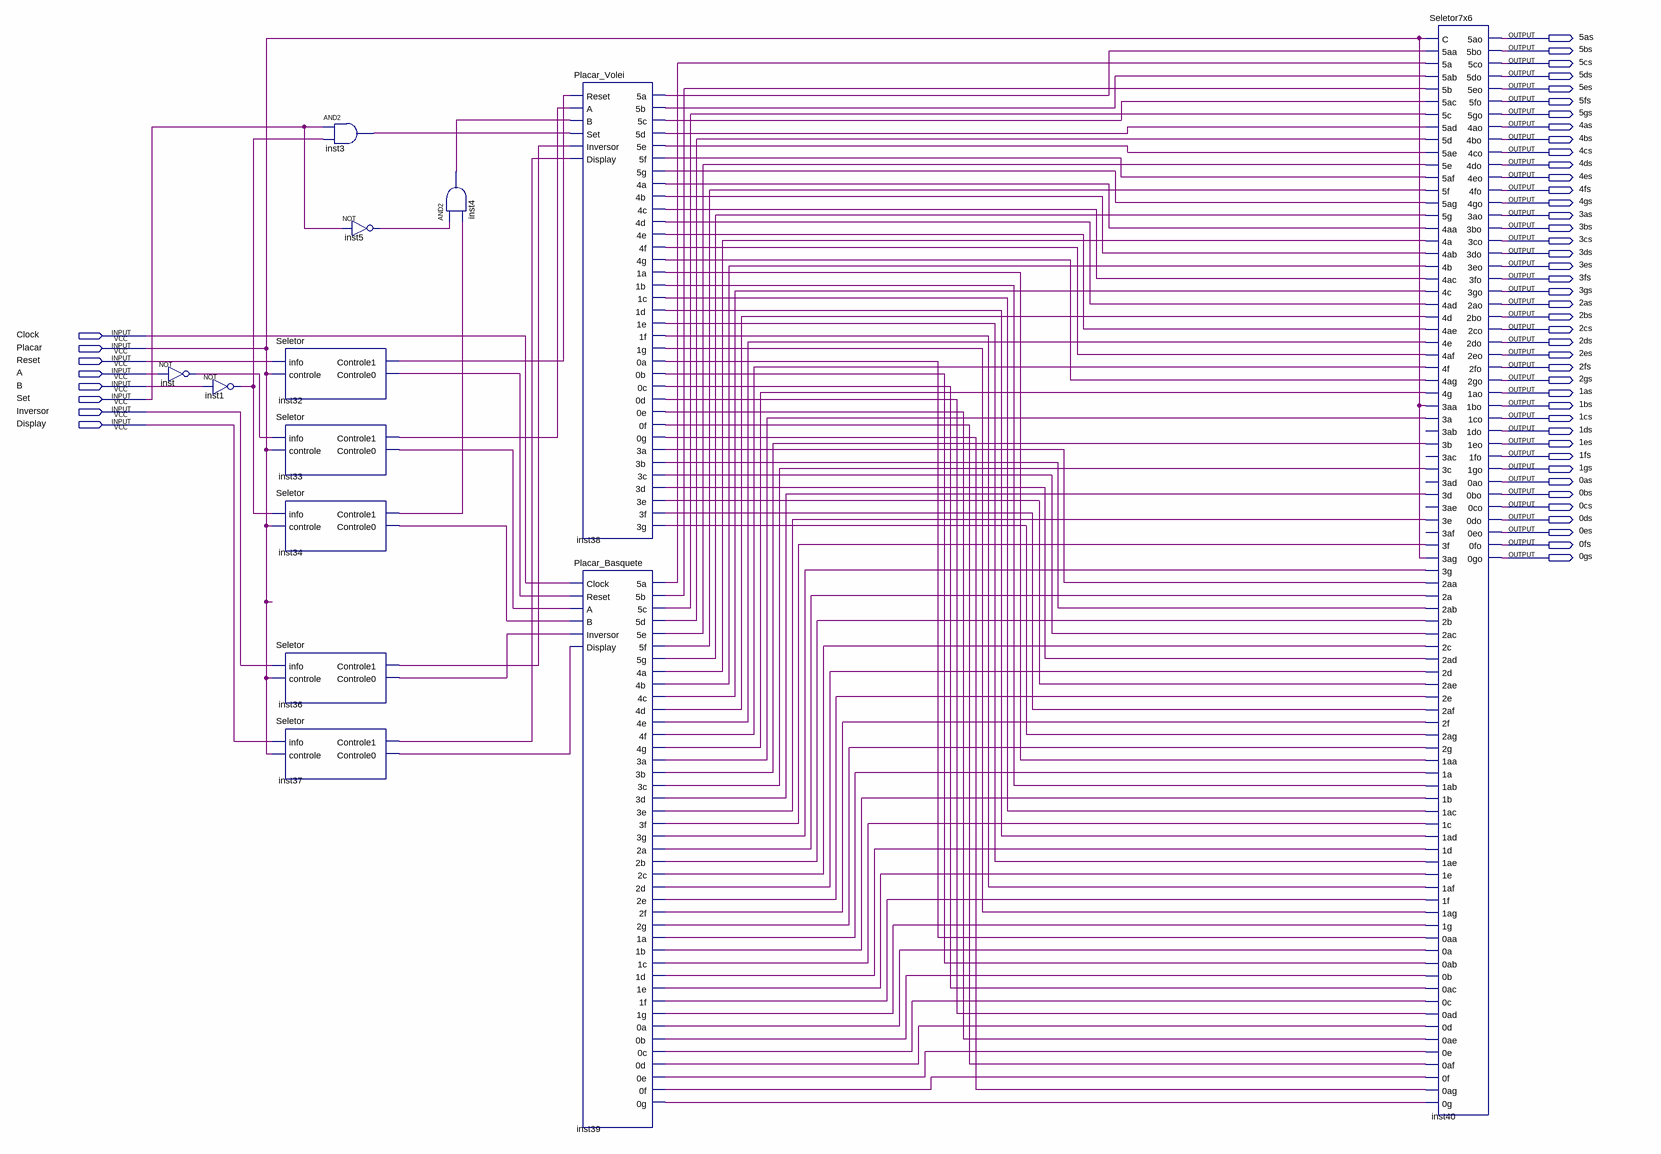
[diagram p0: schematic sheet]
// Quartus schematic Placar.bdf as structural Verilog: 13 symbols, 50 pins
module Placar (
  input  Clock,
  input  Placar,
  input  Reset,
  input  A,
  input  B,
  input  Set,
  input  Inversor,
  input  Display,
  output \5as ,
  output \5bs ,
  output \5cs ,
  output \5ds ,
  output \5es ,
  output \5fs ,
  output \5gs ,
  output \4as ,
  output \4bs ,
  output \4cs ,
  output \4ds ,
  output \4es ,
  output \4fs ,
  output \4gs ,
  output \3as ,
  output \3bs ,
  output \3cs ,
  output \3ds ,
  output \3es ,
  output \3fs ,
  output \3gs ,
  output \2as ,
  output \2bs ,
  output \2cs ,
  output \2ds ,
  output \2es ,
  output \2fs ,
  output \2gs ,
  output \1as ,
  output \1bs ,
  output \1cs ,
  output \1ds ,
  output \1es ,
  output \1fs ,
  output \1gs ,
  output \0as ,
  output \0bs ,
  output \0cs ,
  output \0ds ,
  output \0es ,
  output \0fs ,
  output \0gs 
);

  wire inst1_out, inst3_out, inst4_out, inst5_out, inst32_controle0, inst32_controle1, inst33_controle0,
       inst33_controle1, inst34_controle0, inst34_controle1, inst36_controle0, inst36_controle1,
       inst37_controle0, inst37_controle1, inst38_0a, inst38_0b, inst38_0c, inst38_0d, inst38_0e, inst38_0f,
       inst38_0g, inst38_1a, inst38_1b, inst38_1c, inst38_1d, inst38_1e, inst38_1f, inst38_1g, inst38_3a,
       inst38_3b, inst38_3c, inst38_3d, inst38_3e, inst38_3f, inst38_3g, inst38_4a, inst38_4b, inst38_4c,
       inst38_4d, inst38_4e, inst38_4f, inst38_4g, inst38_5a, inst38_5b, inst38_5c, inst38_5d, inst38_5e,
       inst38_5f, inst38_5g, inst39_0a, inst39_0b, inst39_0c, inst39_0d, inst39_0e, inst39_0f, inst39_0g,
       inst39_1a, inst39_1b, inst39_1c, inst39_1d, inst39_1e, inst39_1f, inst39_1g, inst39_2a, inst39_2b,
       inst39_2c, inst39_2d, inst39_2e, inst39_2f, inst39_2g, inst39_3a, inst39_3b, inst39_3c, inst39_3d,
       inst39_3e, inst39_3f, inst39_3g, inst39_4a, inst39_4b, inst39_4c, inst39_4d, inst39_4e, inst39_4f,
       inst39_4g, inst39_5a, inst39_5b, inst39_5c, inst39_5d, inst39_5e, inst39_5f, inst39_5g, inst_out;

  not inst (inst_out, A);
  not inst1 (inst1_out, B);
  Seletor inst32 (.info(Reset), .controle(Placar), .Controle1(inst32_controle1), .Controle0(inst32_controle0));
  Seletor inst33 (.info(inst_out), .controle(Placar), .Controle1(inst33_controle1), .Controle0(inst33_controle0));
  Seletor inst34 (.info(inst1_out), .controle(Placar), .Controle1(inst34_controle1), .Controle0(inst34_controle0));
  Seletor inst36 (.info(Inversor), .controle(Placar), .Controle1(inst36_controle1), .Controle0(inst36_controle0));
  Seletor inst37 (.info(Display), .controle(Placar), .Controle1(inst37_controle1), .Controle0(inst37_controle0));
  and inst3 (inst3_out, Set, inst1_out);
  not inst5 (inst5_out, Set);
  and inst4 (inst4_out, inst5_out, inst34_controle1);
  Placar_Volei inst38 (
    .Reset(inst32_controle1), .A(inst33_controle1), .B(inst4_out), .Set(inst3_out),
    .Inversor(inst36_controle1), .Display(inst37_controle1), .\5a (inst38_5a), .\5b (inst38_5b),
    .\5c (inst38_5c), .\5d (inst38_5d), .\5e (inst38_5e), .\5f (inst38_5f), .\5g (inst38_5g),
    .\4a (inst38_4a), .\4b (inst38_4b), .\4c (inst38_4c), .\4d (inst38_4d), .\4e (inst38_4e),
    .\4f (inst38_4f), .\4g (inst38_4g), .\1a (inst38_1a), .\1b (inst38_1b), .\1c (inst38_1c),
    .\1d (inst38_1d), .\1e (inst38_1e), .\1f (inst38_1f), .\1g (inst38_1g), .\0a (inst38_0a),
    .\0b (inst38_0b), .\0c (inst38_0c), .\0d (inst38_0d), .\0e (inst38_0e), .\0f (inst38_0f),
    .\0g (inst38_0g), .\3a (inst38_3a), .\3b (inst38_3b), .\3c (inst38_3c), .\3d (inst38_3d),
    .\3e (inst38_3e), .\3f (inst38_3f), .\3g (inst38_3g));
  Placar_Basquete inst39 (
    .Clock(Clock), .Reset(inst32_controle0), .A(inst33_controle0), .B(inst34_controle0),
    .Inversor(inst36_controle0), .Display(inst37_controle0), .\5a (inst39_5a), .\5b (inst39_5b),
    .\5c (inst39_5c), .\5d (inst39_5d), .\5e (inst39_5e), .\5f (inst39_5f), .\5g (inst39_5g),
    .\4a (inst39_4a), .\4b (inst39_4b), .\4c (inst39_4c), .\4d (inst39_4d), .\4e (inst39_4e),
    .\4f (inst39_4f), .\4g (inst39_4g), .\3a (inst39_3a), .\3b (inst39_3b), .\3c (inst39_3c),
    .\3d (inst39_3d), .\3e (inst39_3e), .\3f (inst39_3f), .\3g (inst39_3g), .\2a (inst39_2a),
    .\2b (inst39_2b), .\2c (inst39_2c), .\2d (inst39_2d), .\2e (inst39_2e), .\2f (inst39_2f),
    .\2g (inst39_2g), .\1a (inst39_1a), .\1b (inst39_1b), .\1c (inst39_1c), .\1d (inst39_1d),
    .\1e (inst39_1e), .\1f (inst39_1f), .\1g (inst39_1g), .\0a (inst39_0a), .\0b (inst39_0b),
    .\0c (inst39_0c), .\0d (inst39_0d), .\0e (inst39_0e), .\0f (inst39_0f), .\0g (inst39_0g));
  Seletor7x6 inst40 (
    .C(Placar), .\5aa (inst38_5a), .\5a (inst39_5a), .\5ab (inst38_5b), .\5b (inst39_5b), .\5ac (inst38_5c),
    .\5c (inst39_5c), .\5ad (inst38_5d), .\5d (inst39_5d), .\5ae (inst38_5e), .\5e (inst39_5e),
    .\5af (inst38_5f), .\5f (inst39_5f), .\5ag (inst38_5g), .\5g (inst39_5g), .\4aa (inst38_4a),
    .\4a (inst39_4a), .\4ab (inst38_4b), .\4b (inst39_4b), .\4ac (inst38_4c), .\4c (inst39_4c),
    .\4ad (inst38_4d), .\4d (inst39_4d), .\4ae (inst38_4e), .\4e (inst39_4e), .\4af (inst38_4f),
    .\4f (inst39_4f), .\4ag (inst38_4g), .\4g (inst39_4g), .\3aa (Placar), .\3a (inst39_3a),
    .\3b (inst39_3b), .\3c (inst39_3c), .\3d (inst39_3d), .\3e (inst39_3e), .\3f (inst39_3f), .\3ag (Placar),
    .\3g (inst39_3g), .\2aa (inst38_3a), .\2a (inst39_2a), .\2ab (inst38_3b), .\2b (inst39_2b),
    .\2ac (inst38_3c), .\2c (inst39_2c), .\2ad (inst38_3d), .\2d (inst39_2d), .\2ae (inst38_3e),
    .\2e (inst39_2e), .\2af (inst38_3f), .\2f (inst39_2f), .\2ag (inst38_3g), .\2g (inst39_2g),
    .\1aa (inst38_1a), .\1a (inst39_1a), .\1ab (inst38_1b), .\1b (inst39_1b), .\1ac (inst38_1c),
    .\1c (inst39_1c), .\1ad (inst38_1d), .\1d (inst39_1d), .\1ae (inst38_1e), .\1e (inst39_1e),
    .\1af (inst38_1f), .\1f (inst39_1f), .\1ag (inst38_1g), .\1g (inst39_1g), .\0aa (inst38_0a),
    .\0a (inst39_0a), .\0ab (inst38_0b), .\0b (inst39_0b), .\0ac (inst38_0c), .\0c (inst39_0c),
    .\0ad (inst38_0d), .\0d (inst39_0d), .\0ae (inst38_0e), .\0e (inst39_0e), .\0af (inst38_0f),
    .\0f (inst39_0f), .\0ag (inst38_0g), .\0g (inst39_0g), .\5ao (\5as ), .\5bo (\5bs ), .\5co (\5cs ),
    .\5do (\5ds ), .\5eo (\5es ), .\5fo (\5fs ), .\5go (\5gs ), .\4ao (\4as ), .\4bo (\4bs ), .\4co (\4cs ),
    .\4do (\4ds ), .\4eo (\4es ), .\4fo (\4fs ), .\4go (\4gs ), .\3ao (\3as ), .\3bo (\3bs ), .\3co (\3cs ),
    .\3do (\3ds ), .\3eo (\3es ), .\3fo (\3fs ), .\3go (\3gs ), .\2ao (\2as ), .\2bo (\2bs ), .\2co (\2cs ),
    .\2do (\2ds ), .\2eo (\2es ), .\2fo (\2fs ), .\2go (\2gs ), .\1ao (\1as ), .\1bo (\1bs ), .\1co (\1cs ),
    .\1do (\1ds ), .\1eo (\1es ), .\1fo (\1fs ), .\1go (\1gs ), .\0ao (\0as ), .\0bo (\0bs ), .\0co (\0cs ),
    .\0do (\0ds ), .\0eo (\0es ), .\0fo (\0fs ), .\0go (\0gs ));  // open: 3ab, 3ac, 3ad, 3ae, 3af
endmodule
